# EAGLE design musia (EAGLE 9.0.1)

## Sheet 1 of 4: MCU
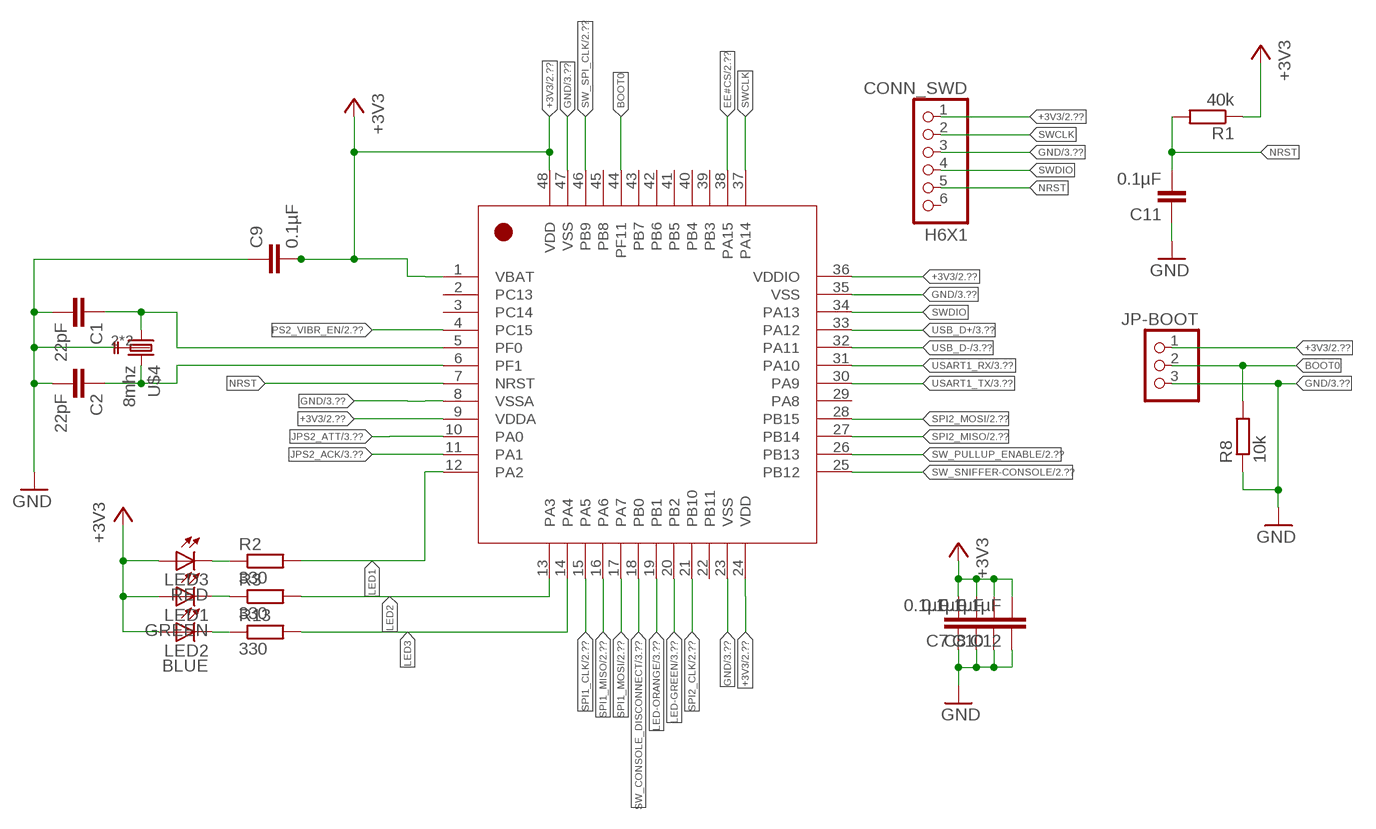
[diagram p0: schematic, sheet 1]

### Parts
C1  22pF  C-EUC0603  [C0603]
C2  22pF  C-EUC0603  [C0603]
C7  0.1µF  C-EUC0603  [C0603]
C8  0.1µF  C-EUC0603  [C0603]
C9  0.1µF  C-EUC0603  [C0603]
C10  0.1µF  C-EUC0603  [C0603]
C11  0.1µF  C-EUC0603  [C0603]
C12  0.1µF  C-EUC0603  [C0603]
CONN_SWD  H6X1  PINHD-1X6  [1X06]
JP-BOOT  PINHD-1X3  [1X03]
LED1  GREEN  LEDCHIPLED_0805  [CHIPLED_0805]
LED2  BLUE  LEDCHIPLED_0805  [CHIPLED_0805]
LED3  RED  LEDCHIPLED_0805  [CHIPLED_0805]
R1  40k  R-EU_R0603  [R0603]
R2  330  R-EU_R0603  [R0603]
R3  330  R-EU_R0603  [R0603]
R8  10k  R-EU_R0603  [R0603]
R13  330  R-EU_R0603  [R0603]
U$1  STM32F042  [LQFP48-7X7]
U$4  8mhz  ABM3BSMD  [ABM3B]

### Nets
+3V3: C7.2 C8.2 C9.2 C10.2 C12.2 CONN_SWD.1 JP-BOOT.1 LED1.A LED2.A LED3.A R1.1 U$1.1(VBAT) U$1.9(VDDA) U$1.24(VDD) U$1.36(VDDIO) U$1.48(VDD) ; also sheet 2,3,4
BOOT0: JP-BOOT.2 R8.2 U$1.44(PF11)
EE#CS: U$1.38(PA15) ; also sheet 2
GND: C1.2 C2.2 C7.1 C8.1 C9.1 C10.1 C11.1 C12.1 CONN_SWD.3 JP-BOOT.3 R8.1 U$1.8(VSSA) U$1.23(VSS) U$1.35(VSS) U$1.47(VSS) U$4.2(GND) U$4.4(GND) ; also sheet 2,3,4
JPS2_ACK: U$1.11(PA1) ; also sheet 3,4
JPS2_ATT: U$1.10(PA0) ; also sheet 3,4
LED1: R2.2 U$1.12(PA2)
LED2: R3.2 U$1.13(PA3)
LED3: R13.2 U$1.14(PA4)
LED-GREEN: U$1.20(PB2) ; also sheet 3
LED-ORANGE: U$1.19(PB1) ; also sheet 3
N$1: LED3.C R2.1
N$2: LED2.C R13.1
N$3: LED1.C R3.1
N$28: C2.1 U$1.6(PF1) U$4.3
N$29: C1.1 U$1.5(PF0) U$4.1
NRST: C11.2 CONN_SWD.5 R1.2 U$1.7(NRST)
PS2_VIBR_EN: U$1.4(PC15) ; also sheet 2
SPI1_CLK: U$1.15(PA5) ; also sheet 2,4
SPI1_MISO: U$1.16(PA6) ; also sheet 2,4
SPI1_MOSI: U$1.17(PA7) ; also sheet 2
SPI2_CLK: U$1.21(PB10) ; also sheet 2
SPI2_MISO: U$1.27(PB14) ; also sheet 2,4
SPI2_MOSI: U$1.28(PB15) ; also sheet 2,4
SW_CONSOLE_DISCONNECT: U$1.18(PB0) ; also sheet 3,4
SW_PULLUP_ENABLE: U$1.26(PB13) ; also sheet 2,4
SW_SNIFFER-CONSOLE: U$1.25(PB12) ; also sheet 2,4
SW_SPI_CLK: U$1.46(PB9) ; also sheet 2
SWCLK: CONN_SWD.2 U$1.37(PA14)
SWDIO: CONN_SWD.4 U$1.34(PA13)
USART1_RX: U$1.31(PA10) ; also sheet 3
USART1_TX: U$1.30(PA9) ; also sheet 3
USB_D+: U$1.33(PA12) ; also sheet 3
USB_D-: U$1.32(PA11) ; also sheet 3
Unconnected: CONN_SWD.6 U$1.2(PC13) U$1.3(PC14) U$1.22(PB11) U$1.29(PA8) U$1.39(PB3) U$1.40(PB4) U$1.41(PB5) U$1.42(PB6) U$1.43(PB7) U$1.45(PB8)

## Sheet 2 of 4: SIGNALS
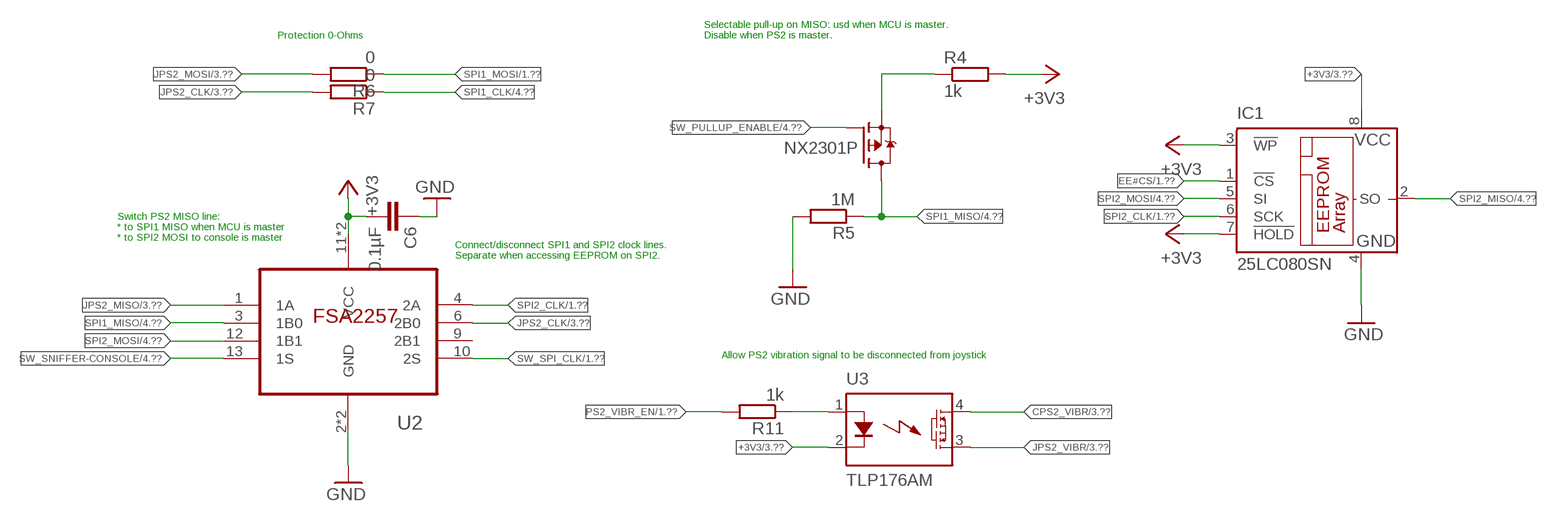
[diagram p1: schematic, sheet 2]

### Parts
C6  0.1µF  C-EUC0603  [C0603]
IC1  25LC080SN  [SO-08]
R4  1k  R-EU_R0603  [R0603]
R5  1M  R-EU_R0603  [R0603]
R6  0  R-EU_R0603  [R0603]
R7  0  R-EU_R0603  [R0603]
R11  1k  R-EU_R0603  [R0603]
U2  FSA2257  FSA2257MTCX  [TSSOP14]
U3  TLP176AM  [SO-6/4]
U$3  NX2301P  [SOT23]

### Nets
+3V3: C6.2 IC1.3(!WP) IC1.7(!HOLD) IC1.8(VCC) R4.2 U2.11(VCC) U2.14(VCC) U3.2(K) ; also sheet 1,3,4
CPS2_VIBR: U3.4(D1) ; also sheet 3,4
EE#CS: IC1.1(!CS) ; also sheet 1
GND: C6.1 IC1.4(GND) R5.2 U2.2(GND) U2.5(GND) ; also sheet 1,3,4
JPS2_CLK: R7.2 U2.6(2B0) ; also sheet 3,4
JPS2_MISO: U2.1(1A) ; also sheet 3,4
JPS2_MOSI: R6.2 ; also sheet 3,4
JPS2_VIBR: U3.3(D2) ; also sheet 3,4
N$6: R4.1 U$3.2(S)
N$7: R11.1 U3.1(A)
PS2_VIBR_EN: R11.2 ; also sheet 1
SPI1_CLK: R7.1 ; also sheet 1,4
SPI1_MISO: R5.1 U2.3(1B0) U$3.3(D) ; also sheet 1,4
SPI1_MOSI: R6.1 ; also sheet 1
SPI2_CLK: IC1.6(SCK) U2.4(2A) ; also sheet 1
SPI2_MISO: IC1.2(SO) ; also sheet 1,4
SPI2_MOSI: IC1.5(SI) U2.12(1B1) ; also sheet 1,4
SW_PULLUP_ENABLE: U$3.1(G) ; also sheet 1,4
SW_SNIFFER-CONSOLE: U2.13(1S) ; also sheet 1,4
SW_SPI_CLK: U2.10(2S) ; also sheet 1
Unconnected: U2.9(2B1)

### Notes on the sheet
- Protection 0-Ohms
- Selectable pull-up on MISO: usd when MCU is master. 
  Disable when PS2 is master.
- Switch PS2 MISO line:
  * to SPI1 MISO when MCU is master
  * to SPI2 MOSI to console is master
- Connect/disconnect SPI1 and SPI2 clock lines.
  Separate when accessing EEPROM on SPI2.
- Allow PS2 vibration signal to be disconnected from joystick

## Sheet 3 of 4: CONNECTORS
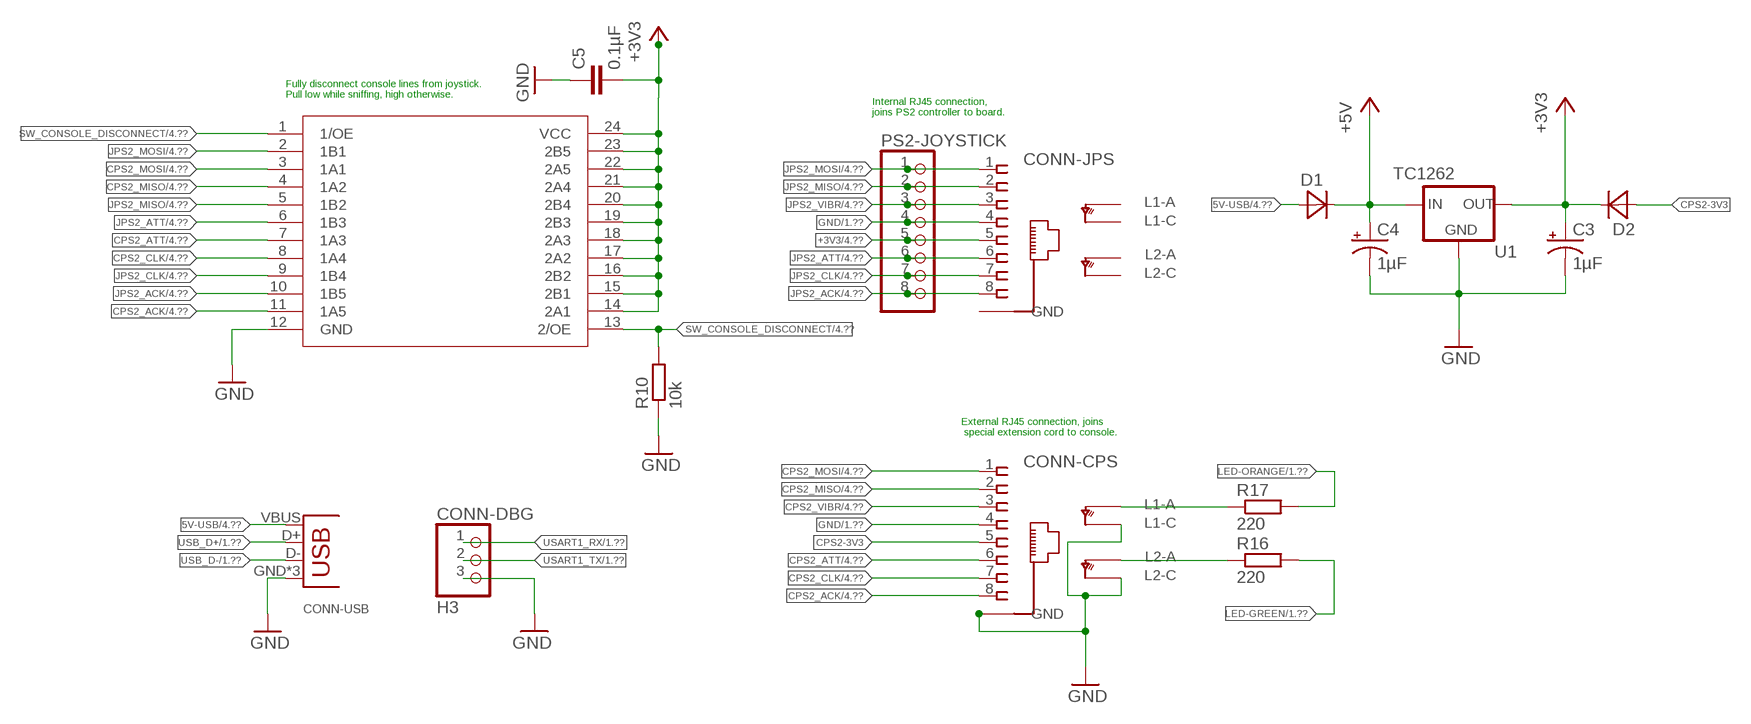
[diagram p2: schematic, sheet 3]

### Parts
C3  1µF  TANT-CAP1206  [EIA3216]
C4  1µF  TANT-CAP1206  [EIA3216]
C5  0.1µF  C-EUC0603  [C0603]
CONN-CPS  RJ45-NIELS  [RJ45-NIELS]
CONN-DBG  H3  PINHD-1X3  [1X03]
CONN-JPS  RJ45-NIELS  [RJ45-NIELS]
CONN-USB  USB-B-FEMALE  USB-B-NIELS  [USB-B-H]
D1  MBR120VLSFT1G  [SOD123]
D2  MBR120VLSFT1G  [SOD123]
PS2-JOYSTICK  PINHD-1X8  [1X08]
R10  10k  R-EU_R0603  [R0603]
R16  220  R-EU_R0603  [R0603]
R17  220  R-EU_R0603  [R0603]
U1  TC1262  TC1262-3.3VDB  [SOT230P700X180-4N]
U$2  SN74CB3Q3384  [SSOP24]

### Nets
5V-USB: CONN-USB.VBUS D1.2(A) ; also sheet 4
+3V3: C3.A(+) C5.2 CONN-JPS.5 D2.1(C) PS2-JOYSTICK.5 U1.3(OUT) U$2.14(2A1) U$2.15(2B1) U$2.16(2B2) U$2.17(2A2) U$2.18(2A3) U$2.19(2B3) U$2.20(2B4) U$2.21(2A4) U$2.22(2A5) U$2.23(2B5) U$2.24(VCC) ; also sheet 1,2,4
+5V: C4.A(+) D1.1(C) U1.1(IN)
CPS2-3V3: CONN-CPS.5 D2.2(A)
CPS2_ACK: CONN-CPS.8 U$2.11(1A5) ; also sheet 4
CPS2_ATT: CONN-CPS.6 U$2.7(1A3) ; also sheet 4
CPS2_CLK: CONN-CPS.7 U$2.8(1A4) ; also sheet 4
CPS2_MISO: CONN-CPS.2 U$2.4(1A2) ; also sheet 4
CPS2_MOSI: CONN-CPS.1 U$2.3(1A1) ; also sheet 4
CPS2_VIBR: CONN-CPS.3 ; also sheet 2,4
GND: C3.C(-) C4.C(-) C5.1 CONN-CPS.4 CONN-CPS.GND@5(GND) CONN-CPS.GND@6(GND) CONN-CPS.LED-GREEN-C(L2C) CONN-CPS.LED-ORANGE-C(L1C) CONN-DBG.3 CONN-JPS.4 CONN-USB.GND CONN-USB.GND@1(GND) CONN-USB.GND@2(GND) PS2-JOYSTICK.4 R10.1 U1.2(GND) U1.4(GND) U$2.12(GND) ; also sheet 1,2,4
JPS2_ACK: CONN-JPS.8 PS2-JOYSTICK.8 U$2.10(1B5) ; also sheet 1,4
JPS2_ATT: CONN-JPS.6 PS2-JOYSTICK.6 U$2.6(1B3) ; also sheet 1,4
JPS2_CLK: CONN-JPS.7 PS2-JOYSTICK.7 U$2.9(1B4) ; also sheet 2,4
JPS2_MISO: CONN-JPS.2 PS2-JOYSTICK.2 U$2.5(1B2) ; also sheet 2,4
JPS2_MOSI: CONN-JPS.1 PS2-JOYSTICK.1 U$2.2(1B1) ; also sheet 2,4
JPS2_VIBR: CONN-JPS.3 PS2-JOYSTICK.3 ; also sheet 2,4
LED-GREEN: R16.2 ; also sheet 1
LED-ORANGE: R17.2 ; also sheet 1
N$4: CONN-CPS.LED-ORANGE-A(L1A) R17.1
N$5: CONN-CPS.LED-GREEN-A(L2A) R16.1
SW_CONSOLE_DISCONNECT: R10.2 U$2.1(1/OE) U$2.13(2/OE) ; also sheet 1,4
USART1_RX: CONN-DBG.1 ; also sheet 1
USART1_TX: CONN-DBG.2 ; also sheet 1
USB_D+: CONN-USB.D+ ; also sheet 1
USB_D-: CONN-USB.D- ; also sheet 1
Unconnected: CONN-JPS.LED-GREEN-A(L2A) CONN-JPS.LED-GREEN-C(L2C) CONN-JPS.LED-ORANGE-A(L1A) CONN-JPS.LED-ORANGE-C(L1C)

### Notes on the sheet
- Fully disconnect console lines from joystick. 
  Pull low while sniffing, high otherwise.
- Internal RJ45 connection,
  joins PS2 controller to board.
- External RJ45 connection, joins
   special extension cord to console.

## Sheet 4 of 4: Test points
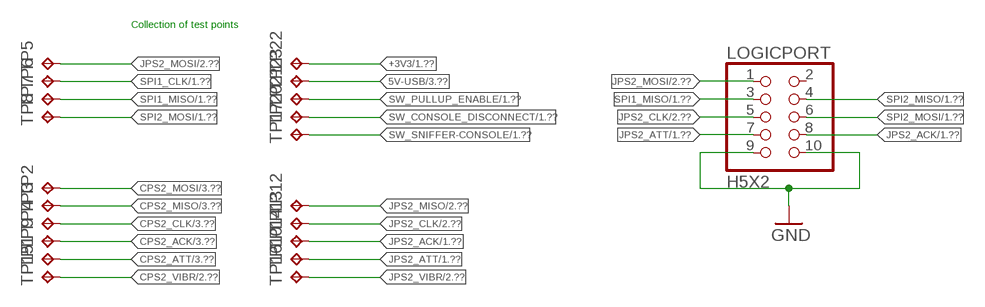
[diagram p3: schematic, sheet 4]

### Parts
LOGICPORT  H5X2  PINHD-2X5  [2X05]
TP1  TPB1,27  [B1,27]
TP2  TPB1,27  [B1,27]
TP3  TPB1,27  [B1,27]
TP4  TPB1,27  [B1,27]
TP5  TPB1,27  [B1,27]
TP6  TPB1,27  [B1,27]
TP7  TPB1,27  [B1,27]
TP8  TPB1,27  [B1,27]
TP9  TPB1,27  [B1,27]
TP10  TPB1,27  [B1,27]
TP12  TPB1,27  [B1,27]
TP13  TPB1,27  [B1,27]
TP14  TPB1,27  [B1,27]
TP15  TPB1,27  [B1,27]
TP16  TPB1,27  [B1,27]
TP17  TPB1,27  [B1,27]
TP20  TPB1,27  [B1,27]
TP21  TPB1,27  [B1,27]
TP22  TPB1,27  [B1,27]
TP23  TPB1,27  [B1,27]

### Nets
5V-USB: TP23.TP ; also sheet 3
+3V3: TP22.TP ; also sheet 1,2,3
CPS2_ACK: TP9.TP ; also sheet 3
CPS2_ATT: TP1.TP ; also sheet 3
CPS2_CLK: TP4.TP ; also sheet 3
CPS2_MISO: TP3.TP ; also sheet 3
CPS2_MOSI: TP2.TP ; also sheet 3
CPS2_VIBR: TP15.TP ; also sheet 2,3
GND: LOGICPORT.9 LOGICPORT.10 ; also sheet 1,2,3
JPS2_ACK: LOGICPORT.8 TP14.TP ; also sheet 1,3
JPS2_ATT: LOGICPORT.7 TP10.TP ; also sheet 1,3
JPS2_CLK: LOGICPORT.5 TP13.TP ; also sheet 2,3
JPS2_MISO: TP12.TP ; also sheet 2,3
JPS2_MOSI: LOGICPORT.1 TP5.TP ; also sheet 2,3
JPS2_VIBR: TP16.TP ; also sheet 2,3
SPI1_CLK: TP6.TP ; also sheet 1,2
SPI1_MISO: LOGICPORT.3 TP7.TP ; also sheet 1,2
SPI2_MISO: LOGICPORT.4 ; also sheet 1,2
SPI2_MOSI: LOGICPORT.6 TP8.TP ; also sheet 1,2
SW_CONSOLE_DISCONNECT: TP20.TP ; also sheet 1,3
SW_PULLUP_ENABLE: TP21.TP ; also sheet 1,2
SW_SNIFFER-CONSOLE: TP17.TP ; also sheet 1,2
Unconnected: LOGICPORT.2

### Notes on the sheet
- Collection of test points

## Power pins joined to a net without a drawn wire
GND: CONN-JPS.GND@5(GND) CONN-JPS.GND@6(GND)

## Library data of the parts
C1 C2 C5-C12 = resistor:C-EU: CAPACITOR, European symbol
C3 C4 = Spark:TANT-CAP: Tantalum SMT
CONN-CPS CONN-JPS = frank:RJ45-NIELS
CONN-DBG JP-BOOT = pinhead:PINHD-1X3: PIN HEADER
CONN-USB = frank:USB: USB Connectors
CONN_SWD = pinhead:PINHD-1X6: PIN HEADER
D1 D2 = frank:MBR120VLSFT1G: DIODE, SCHOTTKY, 1A, 20V, SOD-123FL
IC1 = microchip:25*: Serial EEPROM 4K/ 8K , SPI bus; MF: MICROCHIP; MPN: 25LC080/SN; OC_FARNELL: 1137302; OC_NEWARK: 96K4092
LED1-LED3 = adafruit:LED: LED OSRAM: - CHIPLED LG R971, LG N971, LY N971, LG Q971, LY Q971, LO R971, LY R971 LH N974, LH R974 LS Q976, LO Q976, LY Q976 LO Q996 - Hyper CHIPLED LW Q18S LB Q993, LB Q99A, LB R99A - SideLED LS A670, LO A670, LY A670, LG A670, LP A670 LB A673, LV A673, LT A673, LW A673 LH A674 LY A675 LS A676, LA A676, LO A676, LY A676, LW A676 LS A679, LY A679, LG A679 - Hyper Micro SIDELED® LS Y876, LA Y876, LO Y876, LY Y876 LT Y87S - SmartLED LW L88C, LW L88S LB L89C, LB L89S, LG L890 LS L89K, LO L89K, LY L89K LS L896, LA L896, LO L896, LY L896 - TOPLED LS T670, LO T670, LY T670, LG T670, LP T670 LSG T670, LSP T670, LSY T670, LOP T670, LYG T670 LG T671, LOG T671, LSG T671 LB T673, LV T673, LT T673, LW T673 LH T674 LS T676, LA T676, LO T676, LY T676, LB T676, LH T676, LSB T676, LW T676 LB T67C, LV T67C, LT T67C, LS T67K, LO T67K, LY T67K, LW E67C LS E67B, LA E67B, LO E67B, LY E67B, LB E67C, LV E67C, LT E67C LW T67C LS T679, LY T679, LG T679 LS T770, LO T770, LY T770, LG T770, LP T770 LB T773, LV T773, LT T773, LW T773 LH T774 LS E675, LA E675, LY E675, LS T675 LS T776, LA T776, LO T776, LY T776, LB T776 LHGB T686 LT T68C, LB T68C - Hyper Mini TOPLED® LB M676 - Mini TOPLED Santana® LG M470 LS M47K, LO M47K, LY M47K Source: http://www.osram.convergy.de/
LOGICPORT = pinhead:PINHD-2X5: PIN HEADER
PS2-JOYSTICK = pinhead:PINHD-1X8: PIN HEADER
R1-R8 R10 R11 R13 R16 R17 = resistor:R-EU_: RESISTOR, European symbol
TP1-TP10 TP12-TP17 TP20-TP23 = testpad:TP: Test pad
U1 = frank:TC1262-3.3VDB: IC, 500mA Fixed Output CMOS LDO,3.3V,SOT-223, 3-lead; MPN: TC1262-3.3VDB; OC_FARNELL: 1852183; OC_NEWARK: 53R0370; PACKAGE: SOT-223-3; SUPPLIER: Microchip
U2 = frank:FSA2257MTCX
U3 = musia:TLP176AM
U$1 = musia:STM32F042
U$2 = musia:SN74CB3Q3384
U$3 = musia:NX2301P
U$4 = RPDv6:ABM3B

## Net classes
0 default: width 0.152 mm, drill 0.3 mm, clearance 0.152 mm
1 power: width 0.406 mm, clearance 0.254 mm

## Board
musia
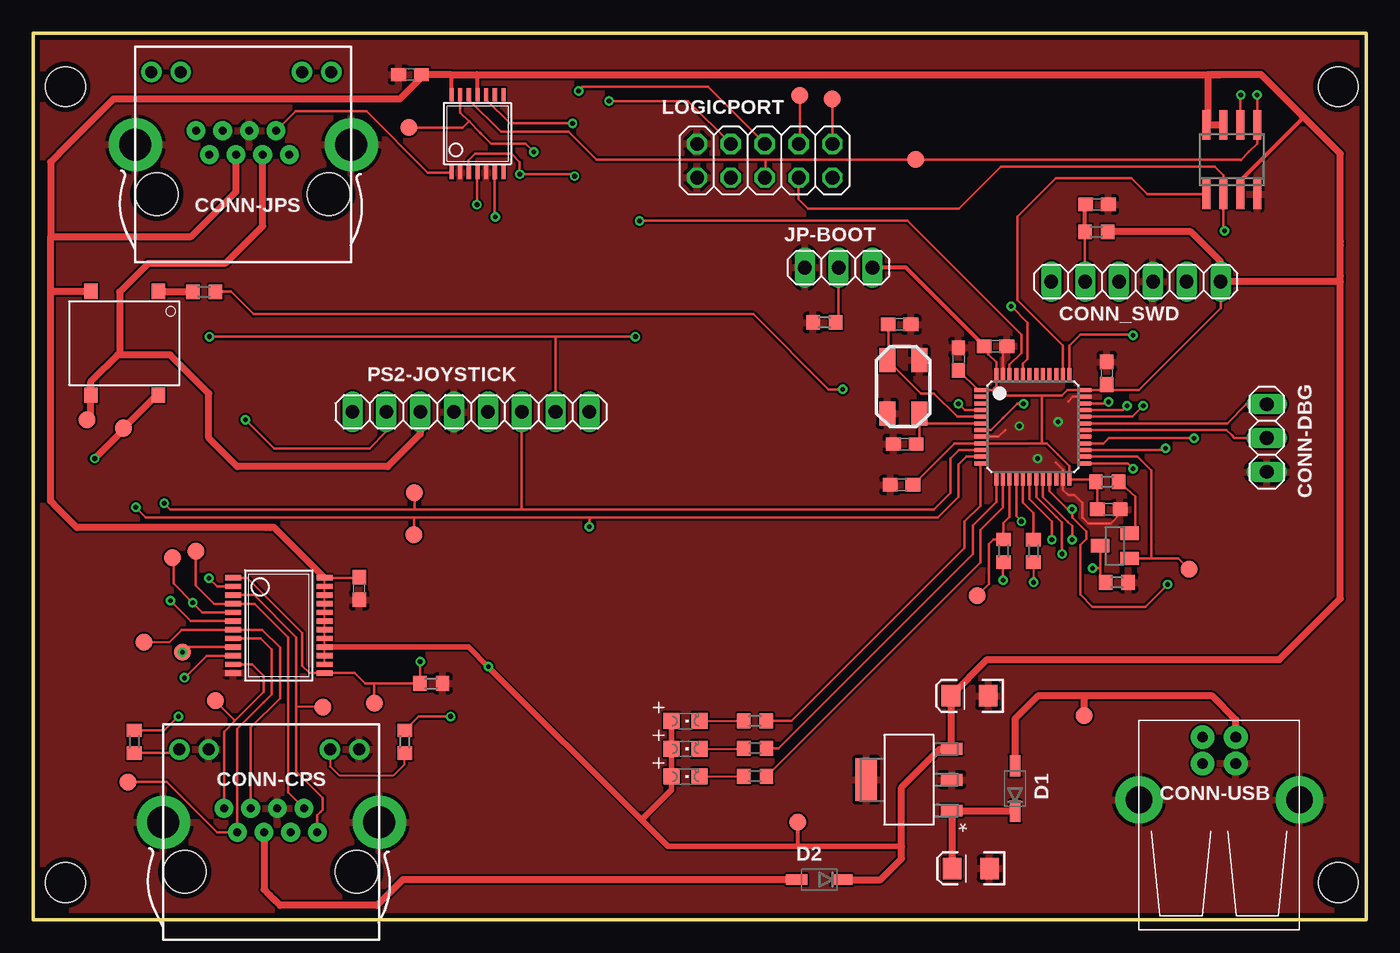
[diagram p4: board, top side]
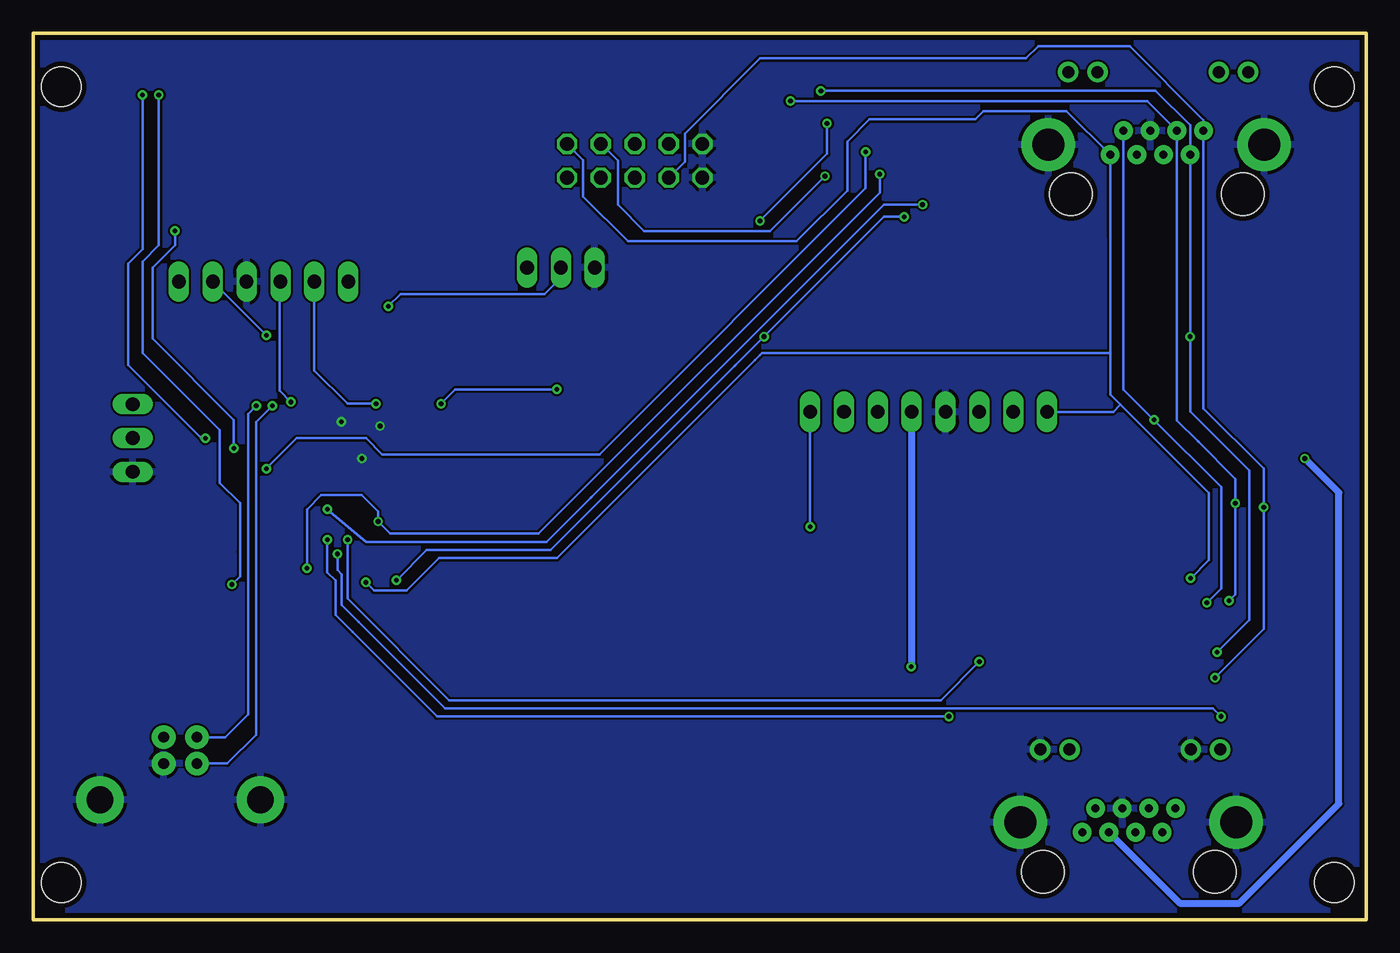
[diagram p5: board, bottom side, seen from below]

Size 100 x 66.5 mm. Coordinates in mm from the lower left corner, seen from the top.
Outline: 100,0 0,0 0,66.5 100,66.5 100,0
Copper layers (1*16): Top 0.0356mm / dielectric 1.5011mm / Bottom 0.0356mm
Design rules "pcbway 6mil 0.3mm drills": minimum track width 6mil, minimum drill 0.3mm, track to track 6mil, track to pad 6mil, pad to pad 6mil, via to via 6mil, smd to smd 0mil, copper to edge 15mil, drill to drill 6mil, minimum pad ring 7mil, minimum via ring 7mil, stop-mask expansion 4mil, vias tented up to drill 999mil, thermal gap 10mil
Holes 3 mm at 2.4,62.5 2.4,2.77 97.9,62.5 97.9,2.77

### Footprints (pad centres in the part's own frame; a part is rotated, then mirrored left to right if it is on the bottom)
C0603 = smd 1.1 x 1: 1 -0.85,0; 2 0.85,0
EIA3216 = smd 1.4 x 1.6: A 1.4,0; C -1.4,0
RJ45-NIELS = drill 0.6 pad 1.397: 1 3.93,-0.84; 2 2.93,0.96; 3 1.93,-0.84; 4 0.93,0.96; 5 -0.07,-0.84; 6 -1.07,0.96; 7 -2.07,-0.84; 8 -3.07,0.96 | drill 2.4 pad 4: GND@5 -7.62,-0.09; GND@6 8.58,-0.09 | drill 0.9 pad 1.524: LED-GREEN-A 4.88,5.37; LED-GREEN-C 7.08,5.37; LED-ORANGE-A -6.42,5.37; LED-ORANGE-C -4.22,5.37 | hole 3.2: -6.02,-3.79; 6.88,-3.79
1X03 = drill 1.016 long: 1 -2.54,0; 2 0,0; 3 2.54,0
USB-B-H = drill 0.8 pad 1.778: D+ 0,1.25; D- 1.981,1.25; GND 0,-1.25; VBUS 1.981,-1.25 | drill 2 pad 3.556: GND@1 -2.718,-6.02; GND@2 -2.718,6.02
1X06 = drill 1.016 long: 1 -6.35,0; 2 -3.81,0; 3 -1.27,0; 4 1.27,0; 5 3.81,0; 6 6.35,0
SOD123 = smd 1.6 x 0.8: 1 -1.7,0; 2 1.7,0
SO-08 = smd 0.6 x 2.2: 1 -1.905,-2.6; 2 -0.635,-2.6; 3 0.635,-2.6; 4 1.905,-2.6; 5 1.905,2.6; 6 0.635,2.6; 7 -0.635,2.6; 8 -1.905,2.6
CHIPLED_0805 = smd 1.2 x 1.2: A 0,-1.05; C 0,1.05
2X05 = drill 1.016 octagon: 1 -5.08,-1.27; 2 -5.08,1.27; 3 -2.54,-1.27; 4 -2.54,1.27; 5 0,-1.27; 6 0,1.27; 7 2.54,-1.27; 8 2.54,1.27; 9 5.08,-1.27; 10 5.08,1.27
1X08 = drill 1.016 long: 1 -8.89,0; 2 -6.35,0; 3 -3.81,0; 4 -1.27,0; 5 1.27,0; 6 3.81,0; 7 6.35,0; 8 8.89,0
R0603 = smd 1 x 1.1: 1 -0.85,0; 2 0.85,0
B1,27 = smd 1.27 x 1.27: TP 0,0
SOT230P700X180-4N = smd 1.626 x 0.889: 1 -3.2,2.311; 2 -3.2,0; 3 -3.2,-2.311 | smd 1.626 x 3.175: 4 3.2,0
TSSOP14 = smd 0.305 x 0.991: 1 -1.95,-2.918; 2 -1.3,-2.918; 3 -0.65,-2.918; 4 0,-2.918; 5 0.65,-2.918; 6 1.3,-2.918; 7 1.95,-2.918; 8 1.95,2.918; 9 1.3,2.918; 10 0.65,2.918; 11 0,2.918; 12 -0.65,2.918; 13 -1.3,2.918; 14 -1.95,2.918
SO-6/4 = smd 1.016 x 1.143: 1 -2.54,-3.886; 2 2.54,-3.886; 3 2.54,3.886; 4 -2.515,3.886
LQFP48-7X7 = smd 0.9 x 0.3: 1 -3.95,2.75; 2 -3.95,2.25; 3 -3.95,1.75; 4 -3.95,1.25; 5 -3.95,0.75; 6 -3.95,0.25; 7 -3.95,-0.25; 8 -3.95,-0.75; 9 -3.95,-1.25; 10 -3.95,-1.75; 11 -3.95,-2.25; 12 -3.95,-2.75; 25 3.95,-2.75; 26 3.95,-2.25; 27 3.95,-1.75; 28 3.95,-1.25; 29 3.95,-0.75; 30 3.95,-0.25; 31 3.95,0.25; 32 3.95,0.75; 33 3.95,1.25; 34 3.95,1.75; 35 3.95,2.25; 36 3.95,2.75 | smd 0.3 x 0.9: 13 -2.75,-3.95; 14 -2.25,-3.95; 15 -1.75,-3.95; 16 -1.25,-3.95; 17 -0.75,-3.95; 18 -0.25,-3.95; 19 0.25,-3.95; 20 0.75,-3.95; 21 1.25,-3.95; 22 1.75,-3.95; 23 2.25,-3.95; 24 2.75,-3.95; 37 2.75,3.95; 38 2.25,3.95; 39 1.75,3.95; 40 1.25,3.95; 41 0.75,3.95; 42 0.25,3.95; 43 -0.25,3.95; 44 -0.75,3.95; 45 -1.25,3.95; 46 -1.75,3.95; 47 -2.25,3.95; 48 -2.75,3.95
SSOP24 = smd 0.4 x 1.2: 1 -3.575,-3.42; 2 -2.925,-3.42; 3 -2.275,-3.42; 4 -1.625,-3.42; 5 -0.975,-3.42; 6 -0.325,-3.42; 7 0.325,-3.42; 8 0.975,-3.42; 9 1.625,-3.42; 10 2.275,-3.42; 11 2.925,-3.42; 12 3.575,-3.42; 13 3.575,3.42; 14 2.925,3.42; 15 2.275,3.42; 16 1.625,3.42; 17 0.975,3.42; 18 0.325,3.42; 19 -0.325,3.42; 20 -0.975,3.42; 21 -1.625,3.42; 22 -2.275,3.42; 23 -2.925,3.42; 24 -3.575,3.42
SOT23 = smd 1 x 1.4: 1 -0.95,-1.1; 2 0.95,-1.1; 3 0,1.1
ABM3B = smd 1.8 x 1.2: 1 -2,-1.2; 2 2,-1.2; 3 2,1.2; 4 -2,1.2

### Placement (x,y rotation side)
C1  64.99,44.65 0 top
C2  65.38,35.68 180 top
C3  70.24,16.79 180 top
C4  70.34,3.83 180 top
C5  24.45,24.84 90 top
C6  28.26,63.4 0 top
C7  69.41,42.06 270 top
C8  80.53,41 270 top
C9  72.2,43.02 180 top
C10  65.14,32.61 0 top
C11  79.81,53.66 180 top
C12  80.69,30.78 180 top
CONN-CPS  17.38,7.38 0 top
CONN-DBG  92.54,36.13 270 top
CONN-JPS  15.28,58.23 0 top
CONN-USB  88.97,11.7 90 top
CONN_SWD  82.73,47.87 180 top
D1  73.66,9.83 90 top
D2  58.97,2.99 180 top
IC1  89.92,57.02 0 top
JP-BOOT  60.42,48.92 180 top
LED1  48.94,12.81 270 top
LED2  48.94,10.73 270 top
LED3  48.94,14.89 270 top
LOGICPORT  54.88,56.94 180 top
PS2-JOYSTICK  32.83,38.1 0 top
R1  79.75,51.61 180 top
R2  54.15,14.91 0 top
R3  54.16,12.85 0 top
R4  80.57,32.85 180 top
R5  81.3,25.3 0 top
R6  75.03,27.66 270 top
R7  72.79,27.66 270 top
R8  59.35,44.81 0 top
R10  29.86,17.72 180 top
R11  12.82,47.11 0 top
R13  54.16,10.75 0 top
R16  27.87,13.34 90 top
R17  7.57,13.34 90 top
TP1  8.29,20.83 0 top
TP2  21.72,15.94 0 top
TP3  12.2,27.64 0 top
TP4  7.11,10.32 0 top
TP5  59.94,61.58 0 top
TP6  70.82,24.29 0 top
TP7  57.51,61.85 0 top
TP8  66.21,57.03 0 top
TP9  13.66,16.42 0 top
TP10  28.6,32.04 0 top
TP12  10.45,27.15 0 top
TP13  11.17,20.05 0 top
TP14  28.57,28.89 0 top
TP15  6.77,36.88 0 top
TP16  4.03,37.49 0 top
TP17  28.17,59.44 0 top
TP20  25.58,16.25 0 top
TP21  86.71,26.3 0 top
TP22  57.34,7.32 0 top
TP23  78.85,15.3 0 top
U1  65.7,10.49 180 top
U2  33.32,58.98 0 top
U3  6.86,43.25 180 top
U$1  74.99,36.98 0 top
U$2  18.42,22.07 270 top
U$3  81.14,28.04 90 top
U$4  65.27,39.98 270 top

### Tracks (layer width: path | path; a pad name or v marks a point on that pad's centre or on a via)
5V-USB
  Top 0.508: 79.01,16.76 88.46,16.76 90.22,15 CONN-USB.VBUS | 79.01,16.76 75.35,16.76 73.66,15.07 D1.2 | TP23.TP 78.85,16.6 79.01,16.76
+3V3  (via drill 0.35)
  Top 0.152: 31.37,63.33 31.31,63.4 | U$2.14 U$2.15 U$2.16 U$2.17 U$2.18 U$2.19 U$2.20 U$2.21 U$2.22 U$2.23 U$2.24 | 79.84,32.89 R4.2
  Top 0.203: U$1.1 71.24,39.73 | 71.24,39.73 71.95,39.73 72.1,39.88 | 72.1,39.88 72.24,40.02 U$1.48 72.24,41.82 71.65,42.41 C9.2 | 75.66,35.73 76.05,35.73 76.88,34.9 77.74,34.04 U$1.24 79.7,33.03 R4.2 | 75.66,35.73 75.2,35.73 74.67,35.73 U$1.9 69.11,35.73 C10.2 | 57.34,5.61 57.22,5.49 | 95.16,60.05 95.16,60.35 | 80.53,39.73 U$1.36 77.59,39.73 77.18,39.32 75.66,39.32 | 80.53,39.73 82.93,39.73 89.08,45.88 CONN_SWD.1 | 75.66,39.32 72.66,39.32 72.1,39.88 | 75.66,39.32 75.66,35.73 | U$2.24 24.41,25.64 C5.2 | C6.2 29.33,63.4 | C12.2 79.84,32.89 | C7.2 70.89,39.73 71.24,39.73 | C8.2 80.53,39.73
  Top 0.305: U2.14 31.37,63.33 | U2.11 33.32,63.37 33.29,63.4 | TP22.TP 57.34,5.61 | IC1.3 90.55,55.43 95.16,60.05 | C9.2 65.45,48.92 JP-BOOT.1
  Top 0.406: 65.14,5.49 59.35,5.49 57.22,5.49 47.62,5.49 45.63,7.47 | U$2.16 26.74,20.45 32.66,20.45 v34.13,18.97 45.63,7.47 | 45.63,7.47 47.89,9.72 LED2.A LED1.A LED3.A
  Top 0.508: D2.1 63.56,2.99 65.14,4.57 65.14,5.49 65.14,9.91 68.04,12.8 68.65,12.8 | 68.65,12.8 U1.3 | 68.65,12.8 68.84,12.99 C3.A 71.55,19.51 93.49,19.51 98.06,24.08 98.06,47.85 | CONN-JPS.5 15.21,54.62 11.8,51.21 1.29,51.21 | 1.29,46.94 1.29,31.39 1.82,30.86 3.27,29.41 17.44,29.41 | 1.29,46.94 1.29,51.21 | 1.29,51.21 1.29,56.85 2.5,58.06 6.01,61.57 27.5,61.57 29.33,63.4 31.31,63.4 33.29,63.4 88.15,63.4 | 17.77,29.41 17.44,29.41 | U3.2 1.48,47.13 1.29,46.94 | 88.15,63.4 88.31,63.4 | 88.31,63.4 89.1,63.4 | 98.06,47.85 98.06,48.31 98.06,50.6 98.06,50.9 98.06,57.45 95.16,60.35 92.12,63.4 88.31,63.4 | IC1.7 IC1.8 88.15,59.77 88.15,63.4 | R1.1 86.83,51.61 89.08,49.37 CONN_SWD.1 98.05,47.87 98.06,47.85 | U$2.24 18.07,29.41 17.44,29.41
  Bottom 0.508: PS2-JOYSTICK.5 34.1,19 v34.13,18.97
+5V
  Top 0.508: D1.1 69.1,8.13 | 69.1,8.13 68.95,8.13 U1.1 | C4.A 68.94,7.97 69.1,8.13
BOOT0  (via drill 0.35)
  Top 0.203: U$1.44 74.24,41.71 74.59,42.06 74.59,44.81 v73.37,46.02 | R8.2 60.42,45.02 JP-BOOT.2
  Bottom 0.203: v73.37,46.02 72.46,46.94 61.64,46.94 60.42,48.16 JP-BOOT.2
CPS2-3V3
  Top 0.508: CONN-CPS.5 17.31,2.26 17.75,1.83 | 18.18,1.4 17.75,1.83 | D2.2 27.72,2.99 25.79,1.07 18.51,1.07 17.75,1.83
CPS2_ACK
  Top 0.152: 15.08,15 15.08,14.86
  Top 0.203: CONN-CPS.8 14.31,14.09 15.08,14.86 17.29,17.07 17.29,18.29 16.43,19.14 U$2.11 | TP9.TP 15.08,15
CPS2_ATT
  Top 0.152: TP1.TP 10.23,20.83 11.14,21.75
  Top 0.203: CONN-CPS.6 16.31,14.41 18.51,16.61 18.51,20.42 17.18,21.75 U$2.7 11.14,21.75
CPS2_CLK
  Top 0.203: U$2.8 17.07,21.09 17.9,20.27 17.9,16.9 17.3,16.3 15.31,14.31 CONN-CPS.7 13.79,6.54 10.01,10.32 TP4.TP
CPS2_MISO
  Top 0.152: U$2.4 15.15,23.7
  Top 0.203: 15.15,23.7 16.61,23.7 19.12,21.18 19.12,9.54 CONN-CPS.2 | TP3.TP 12.2,25.05 13.56,23.7 U$2.4
CPS2_MOSI
  Top 0.152: 21.71,8.23 21.55,8.08 | TP2.TP 19.79,15.94 19.73,16
  Top 0.203: CONN-CPS.1 21.31,7.83 21.55,8.08 | U$2.3 16.57,24.34 19.73,21.18 19.73,16 19.73,11.12 21.71,9.14 21.71,8.23
CPS2_VIBR  (via drill 0.35)
  Top 0.203: 6.77,36.76 TP15.TP | 9.25,39.36 U3.4
  Top 0.508: v4.6,34.59 6.77,36.76 | TP15.TP 9.25,39.36
  Bottom 0.508: CONN-CPS.3 13.99,1.22 9.52,1.22 4.33,6.4 | 4.33,6.4 4.18,6.55 | 4.33,6.4 2.05,8.69 2.05,32.04 v4.6,34.59
EE#CS
  Top 0.203: U$1.38 77.24,43.07 73.83,46.48 73.83,52.73 76.72,55.63 82.36,55.63 83.56,54.42 IC1.1
GND  (via drill 0.35)
  Top 0.203: 76.72,34.29 77.24,33.77 U$1.23 77.24,32.25 77.64,31.85 78.1,31.85 78.7,31.24 78.7,30.18 79.16,29.72 80.84,29.72 81.54,30.42 C12.1 | U$1.35 78.01,39.23 77.64,38.86 | U$1.8 72.42,36.23 72.91,36.73 | C9.1 72.74,42.72 U$1.47
  other vias: 75.35,34.59 76.88,37.34 73.98,37.03
  pour Top: 0,0 0,66.5 100,66.5 100,0
  pour Bottom: 0,0 100,0 100,66.5 0,66.5
JPS2_ACK  (via drill 0.35)
  Top 0.203: U$1.11 70,34.73 69.41,34.14 69.41,31.7 67.89,30.18 41.82,30.18 | U$2.10 13,19.8 v11.34,18.14 | v7.69,30.94 8.45,30.18 28.57,30.18 | 41.82,30.18 28.57,30.18 | TP14.TP 28.57,30.18 | 28.57,30.18 | v41.72,29.46 41.72,30.07 41.82,30.18
  Bottom 0.203: v11.34,18.14 7.69,21.79 v7.69,30.94 7.69,33.83 12.21,38.36 CONN-JPS.8 12.21,60 17.75,65.53 24.6,65.53 25.52,64.62 45.48,64.62 51.12,58.98 51.12,56.88 LOGICPORT.8 | PS2-JOYSTICK.8 v41.72,29.46
JPS2_ATT  (via drill 0.35)
  Top 0.203: U$2.6 12.87,22.39 | 12.87,22.39 12.72,22.39 | v10.28,23.93 11.81,22.39 12.87,22.39 | U$1.10 69.43,35.23 68.8,34.59 68.8,32 67.58,30.79 36.64,30.79 | v9.82,31.24 10.28,30.79 28.57,30.79 | 36.64,30.79 28.57,30.79 | TP10.TP 28.59,30.81 28.57,30.79 | v43.2,61.42 49.13,61.42 LOGICPORT.7 | PS2-JOYSTICK.6 36.64,30.79
  Bottom 0.203: 12.64,35.89 14.21,37.46 CONN-JPS.6 16.44,61.42 16.68,61.42 v43.2,61.42 | 12.64,35.89 12.56,35.81 | 12.64,35.89 9.82,33.07 v9.82,31.24 9.82,24.38 v10.28,23.93
JPS2_CLK  (via drill 0.35)
  Top 0.152: v11.19,20.05 TP13.TP
  Top 0.203: U$2.9 13.35,20.45 11.56,20.45 TP13.TP | R7.2 72.76,26.78 v72.76,25.45 | U2.6 34.62,52.77 v34.66,52.73 | v13.21,43.74 39.23,43.74 | 39.23,43.74 v45.18,43.74 | v40.91,62.18 41.22,62.48 50.6,62.48 LOGICPORT.5 | PS2-JOYSTICK.7 39.18,43.69 39.23,43.74
  Bottom 0.203: v11.19,20.05 8.75,22.49 8.75,33.07 8.75,33.68 13.21,38.14 v13.21,43.74 CONN-JPS.7 13.21,59.59 15.8,62.18 16.53,62.18 v40.91,62.18 | v72.76,25.45 70.48,27.74 61.18,27.74 47.39,41.53 | 47.31,41.6 47.39,41.53 | 47.39,41.53 v45.18,43.74 36.19,52.73 v34.66,52.73
JPS2_MISO  (via drill 0.35)
  Top 0.203: U$2.5 12.68,23.05 v11.95,23.77 10.53,25.2 10.53,27.07 TP12.TP | CONN-JPS.2 19.68,60.66 24.99,60.66 29.59,56.06 U2.1 | v15.92,37.49 18.05,35.36 25.21,35.36 26.48,36.63 PS2-JOYSTICK.2
  Bottom 0.203: CONN-JPS.2 18.21,39.78 v15.92,37.49 10.89,32.46 10.89,24.84 v11.95,23.77
JPS2_MOSI  (via drill 0.35)
  Top 0.152: R6.2 75.05,26.79 v75.05,25.3
  Top 0.203: U$2.2 13.78,25 v13.17,25.6 | TP5.TP 59.96,61.56 LOGICPORT.1
  Bottom 0.203: 19.21,42.52 19.21,51.21 CONN-JPS.1 22.48,60.66 28.72,60.66 29.33,60.05 37.25,60.05 38.93,58.37 38.93,54.71 42.74,50.9 55.39,50.9 58.74,54.25 58.74,56.99 LOGICPORT.1 | 19.21,42.52 19.21,39.41 18.43,38.63 | v13.17,25.6 11.8,26.98 11.8,32 18.43,38.63 | v75.05,25.3 74.44,24.69 72,24.69 69.56,27.13 60.72,27.13 45.86,41.99 | 45.86,41.99 45.48,42.37 | 45.86,41.99 45.33,42.52 19.21,42.52 | PS2-JOYSTICK.1 18.96,38.1 18.43,38.63
JPS2_VIBR
  Top 0.508: CONN-JPS.3 17.21,52.04 16.3,51.13 14.39,49.23 8.6,49.23 6.47,47.09 6.47,42.52 | U3.3 4.32,39.62 | TP16.TP 4.32,37.78 4.32,39.62 | PS2-JOYSTICK.3 29.02,36.42 26.58,33.98 15.31,33.98 13.17,36.12 13.17,39.47 10.28,42.37 6.32,42.37 6.47,42.52 | 4.32,39.62 4.32,40.37 6.47,42.52
LED1
  Top 0.203: R2.2 56.89,14.91 69.87,27.89 69.87,29.87 71.04,31.04 U$1.12
LED2
  Top 0.203: R3.2 55.89,12.85 70.48,27.43 70.48,29.57 72.24,31.33 U$1.13
LED3
  Top 0.203: R13.2 71.04,26.78 71.04,29.22 72.74,30.92 U$1.14
LED-GREEN  (via drill 0.35)
  Top 0.203: R16.2 28.92,15.24 v31.31,15.24 | U$1.20 75.74,31.72 77.62,29.85 77.94,29.52 v77.94,28.5
  Bottom 0.203: v31.31,15.24 69.71,15.24 76.04,21.57 77.33,22.86 77.33,25.45 77.94,26.06 v77.94,28.5
LED-ORANGE  (via drill 0.35)
  Top 0.203: R17.2 9.84,14.19 v10.89,15.24 | U$1.19 75.24,31.72 76.75,30.21 77.18,29.78 v77.18,27.43
  Bottom 0.203: v10.89,15.24 11.5,15.85 69.1,15.85 75.58,22.33 76.88,23.62 76.88,25.91 77.18,26.21 v77.18,27.43
N$1
  Top 0.152: LED3.C 53.28,14.89 R2.1
N$2
  Top 0.152: LED2.C 53.29,10.73 R13.1
N$3
  Top 0.152: LED1.C 53.27,12.81 R3.1
N$4
  Top 0.203: R17.1 10.7,12.49 CONN-CPS.LED-ORANGE-A
N$5
  Top 0.152: CONN-CPS.LED-GREEN-A 22.26,11.49 22.93,10.82 27.04,10.82 27.87,11.65 R16.1
N$6
  Top 0.152: 81.55,32.88 R4.1
  Top 0.203: R4.1 82.67,31.76 82.67,29.42 U$3.2 | 82.67,29.26 82.52,29.11 82.4,28.99 U$3.2 | 82.21,28.8 82.29,28.88 82.29,28.95 U$3.2
N$7
  Top 0.508: U3.1 11.95,47.13 R11.1
N$28
  Top 0.203: 69.23,37.23 69.26,37.23 | 69.26,37.23 U$1.6 | 69.26,37.23 67.04,37.23 66.38,37.89 U$4.3 66.47,35.92 C2.1
N$29
  Top 0.203: C1.1 64.14,42.05 U$4.1 66.58,39.47 67.58,39.47 69.32,37.73 70.02,37.73 U$1.5
NRST  (via drill 0.35)
  Top 0.203: R1.2 78.9,47.88 CONN_SWD.5 | U$1.7 71.85,36.73 72.76,37.64 | 72.79,37.67 72.76,37.64 | v74.29,38.71 73.83,38.71 72.76,37.64
  Top 0.305: R1.2 78.9,53.6 C11.2
  Bottom 0.203: CONN_SWD.5 78.92,41.21 76.42,38.71 v74.29,38.71
PS2_VIBR_EN  (via drill 0.35)
  Top 0.203: R11.2 14.85,47.11 16.54,45.41 54.02,45.41 59.66,39.78 v60.72,39.78 | U$1.4 69.89,38.23 v69.41,38.71
  Bottom 0.203: v69.41,38.71 68.34,39.78 v60.72,39.78
SPI1_CLK
  Top 0.152: 73.24,28.68 R7.1
  Top 0.203: U$1.15 73.24,30.2 72.79,29.75 R7.1 72.02,28.51 71.69,28.19 71.69,25.91 71.69,25.17 TP6.TP
SPI1_MISO  (via drill 0.35)
  Top 0.203: U$1.16 73.74,30.72 73.74,30.26 v74.13,29.87 | TP7.TP 57.51,58.3 LOGICPORT.3 | U2.3 32.67,56.99 33.14,57.45 35.88,57.45 36.49,56.84 v36.49,55.93 40.45,55.93 v40.6,55.78 | R5.1 80.45,25.39 80.38,25.45 80.04,25.79 80.04,26.21 | U$3.3 80.04,26.21 | v79.47,26.36 79.89,26.36 80.04,26.21
  Bottom 0.203: v36.49,55.93 36.49,54.56 62.09,28.96 72.15,28.96 73.22,28.96 v74.13,29.87 74.13,30.63 75.35,31.85 78.4,31.85 79.47,30.79 v79.47,26.36 | LOGICPORT.3 56.15,56.94 56.15,53.65 54.17,51.66 44.72,51.66 v40.6,55.78
SPI1_MOSI
  Top 0.203: R6.1 75.03,30.49 74.24,31.29 74.24,31.85 U$1.17
SPI2_CLK  (via drill 0.35)
  Top 0.203: U$1.21 76.24,32.16 77.61,30.79 v77.94,30.79 77.94,30.18 79.01,29.11 79.01,28.55 78.55,28.1 78.55,24.38 79.47,23.47 83.43,23.47 v85.11,25.15 | IC1.6 90.55,61.83 v90.59,61.87 | v33.29,53.65 33.29,56.02 U2.4
  Bottom 0.203: 58.21,31.62 61.48,28.35 74.74,28.35 | 58.21,31.62 58.13,31.7 | 74.89,28.35 74.74,28.35 | v77.94,30.79 75.05,28.35 74.74,28.35 | v90.59,61.87 90.59,50.6 91.81,49.38 91.81,42.52 86.02,36.73 86.02,32.77 84.5,31.24 84.5,27.58 84.5,25.76 v85.11,25.15 | v33.29,53.65 36.19,53.65 58.21,31.62
SPI2_MISO  (via drill 0.35)
  Top 0.203: LOGICPORT.4 57.42,54.05 58.13,53.34 69.46,53.34 72.61,56.49 88.66,56.49 89.28,55.87 IC1.2 89.28,51.76 v89.37,51.66 | v84.95,35.36 84.83,35.23 U$1.27
  Bottom 0.203: v89.37,51.66 89.37,50.6 91.05,48.92 91.05,43.59 84.95,37.49 v84.95,35.36
SPI2_MOSI  (via drill 0.35)
  Top 0.203: U$1.28 80.3,35.73 80.69,36.12 v87.09,36.12 | v91.81,61.87 v91.82,61.87 IC1.5 91.82,58.23 91.2,57.61 | 90.59,57 91.2,57.61 | 37.86,59.13 37.71,59.13 | 37.71,59.13 35.08,59.13 32.67,61.54 U2.12 | 91.2,57.61 90.62,57.03 TP8.TP 54.93,57.03 | 54.93,57.03 42.25,57.03 40.15,59.13 37.71,59.13 | LOGICPORT.6 54.93,55.72 54.93,57.03
  Bottom 0.203: v91.81,61.87 91.81,50.29 92.88,49.23 92.88,41.6 87.39,36.12 v87.09,36.12
SW_CONSOLE_DISCONNECT  (via drill 0.35)
  Top 0.152: 25.58,17.63 25.67,17.71
  Top 0.203: U$2.1 16.03,25.64 20.18,21.49 20.18,19.05 20.74,18.5 U$2.13 24.11,18.5 24.89,17.71 25.67,17.71 R10.2 29.01,19.34 v29.02,19.36 | TP20.TP 25.58,17.63 | U$1.18 74.74,31.55 76.42,29.87 v76.42,28.5
  Bottom 0.203: v76.42,28.5 76.42,24.08 68.8,16.46 31.92,16.46 v29.02,19.36
SW_PULLUP_ENABLE
  Top 0.203: U$3.1 83.39,27.09 83.82,27.09 | U$1.26 82.84,34.73 83.89,33.68 83.89,28.35 83.89,27.58 83.89,27.16 83.82,27.09 | TP21.TP 85.91,27.09 83.82,27.09
SW_SNIFFER-CONSOLE  (via drill 0.35)
  Top 0.203: U2.13 32.02,60.55 32.68,59.89 | 32.68,59.89 33.52,59.05 | 33.52,59.05 33.59,58.98 | TP17.TP 32.22,59.44 32.68,59.89 | 33.52,59.05 34.36,58.22 36.95,58.22 v37.56,57.61 | v82.52,33.83 82.12,34.23 U$1.25
  Bottom 0.203: v37.56,57.61 37.56,54.86 57.52,34.9 73.83,34.9 75.05,36.12 80.23,36.12 v82.52,33.83
SW_SPI_CLK  (via drill 0.35)
  Top 0.203: U$1.46 73.24,41.63 74.13,42.52 74.13,43.89 65.6,52.43 v45.48,52.43 | v40.45,59.74 35.77,59.74 33.97,61.54 U2.10
  Bottom 0.203: v45.48,52.43 40.45,57.45 v40.45,59.74
SWCLK  (via drill 0.35)
  Top 0.203: U$1.37 77.74,43.08 78.55,43.89 82.47,43.89 v82.52,43.84
  Bottom 0.203: CONN_SWD.2 v82.52,43.84
SWDIO  (via drill 0.35)
  Top 0.203: v80.69,38.84 80.58,38.73 U$1.34
  Bottom 0.203: v80.69,38.84 81.54,39.69 81.54,47.79 CONN_SWD.4
USART1_RX
  Top 0.203: U$1.31 89.57,37.23 91.01,38.67 CONN-DBG.1
USART1_TX
  Top 0.203: U$1.30 89.52,36.73 89.91,36.35 90.12,36.13 CONN-DBG.2
USB_D+  (via drill 0.35)
  Top 0.203: U$1.33 81.73,38.23 v82.06,38.56
  Bottom 0.203: CONN-USB.D+ 85.44,11.7 83.28,13.87 83.28,32.77 83.28,32.92 83.28,37.34 v82.06,38.56
USB_D-  (via drill 0.35)
  Top 0.203: U$1.32 82.45,37.73 v83.28,38.56
  Bottom 0.203: v83.28,38.56 83.89,37.95 83.89,32.92 83.89,15.39 85.6,13.68 CONN-USB.D-

### Text on the board
tValues: 8MHz | MUSIA rev.1 / frank@zzattack.org